# EAGLE schematic balancing_robot (EAGLE 7.4.0)
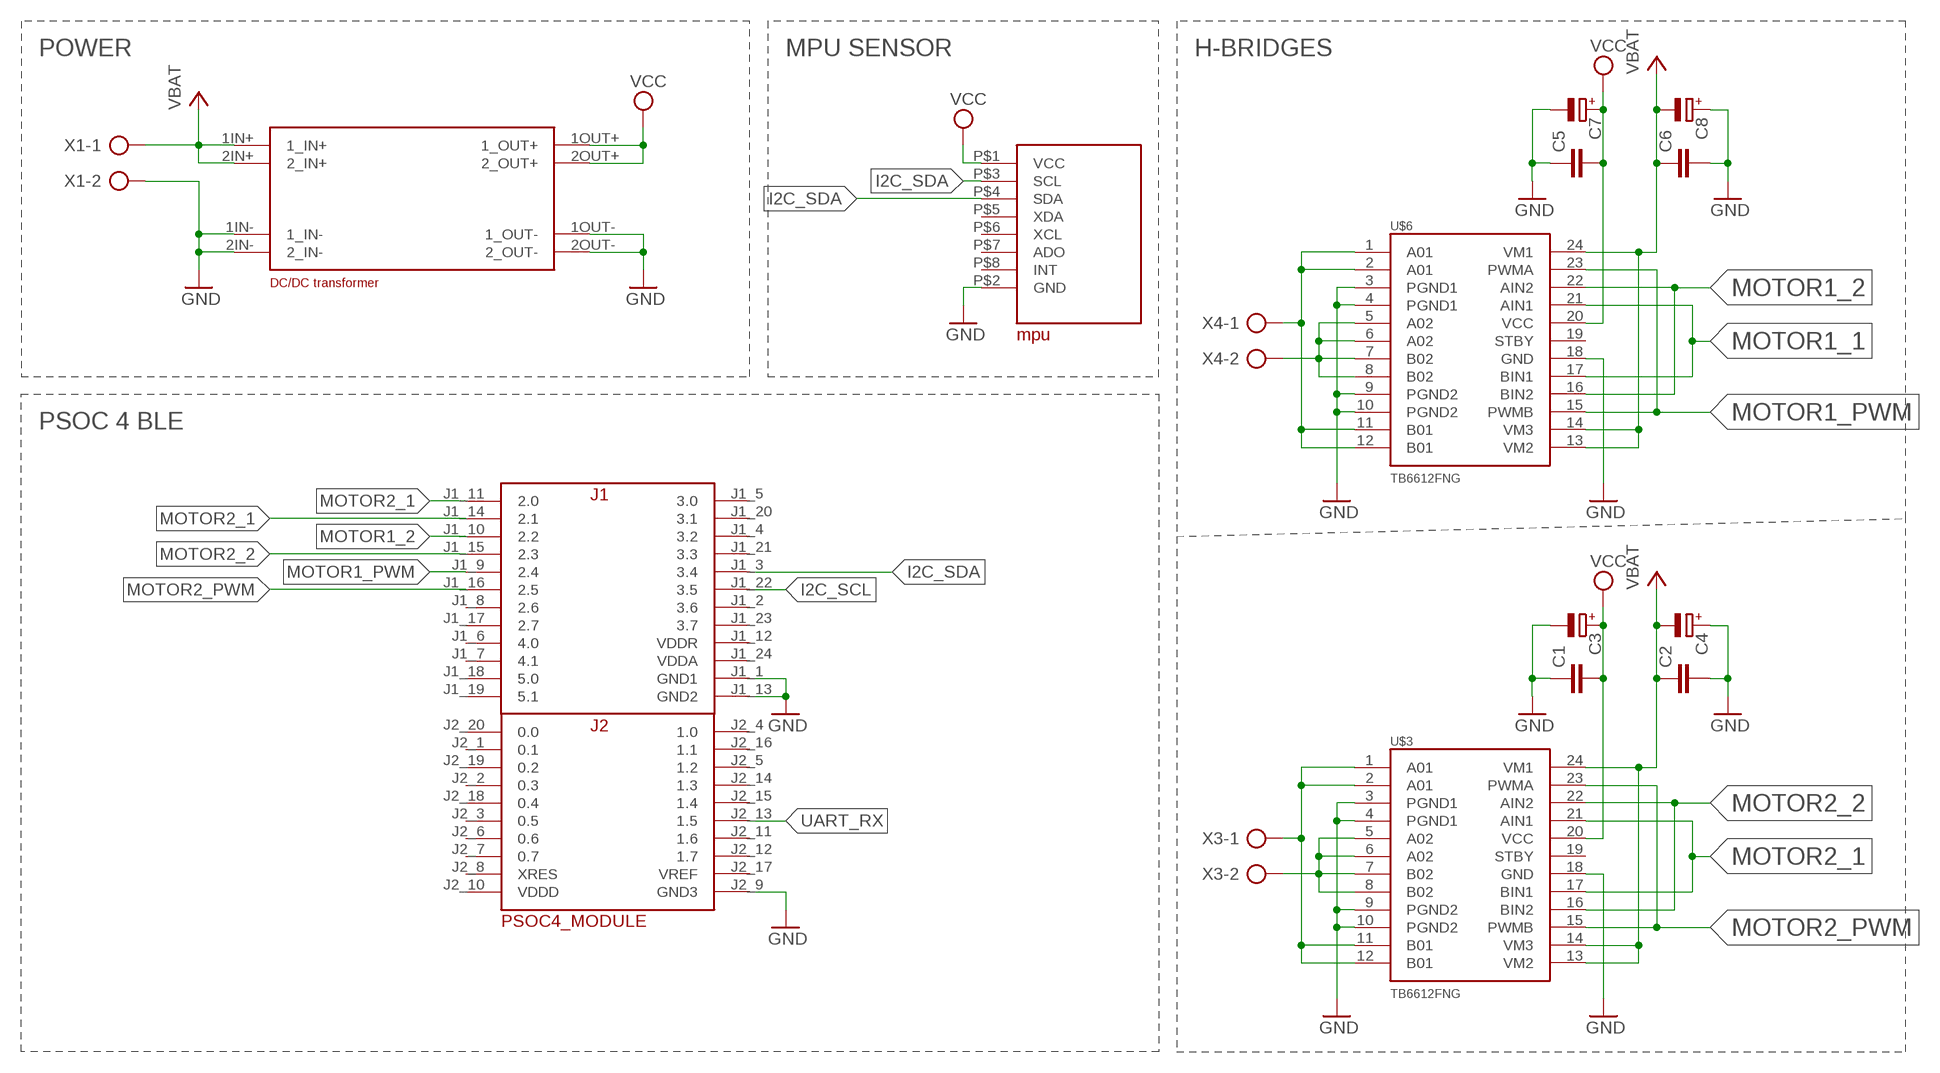
[diagram p0: schematic, sheet 1]

## Parts
C1  C-EUC0603  [C0603]
C2  C-EUC0603  [C0603]
C3  CPOL-EU153CLV-0405  [153CLV-0405]
C4  CPOL-EU153CLV-0405  [153CLV-0405]
C5  C-EUC0603  [C0603]
C6  C-EUC0603  [C0603]
C7  CPOL-EU153CLV-0405  [153CLV-0405]
C8  CPOL-EU153CLV-0405  [153CLV-0405]
U$1  PSOC4_MODULE  [PSOC4_MODULE]
U$3  TB6612FNG  [SSOP24]
U$4  TRANSFORMER  [TRANSFORMER]
U$5  MPU  [MPU]
U$6  TB6612FNG  [SSOP24]
X1  AK500/2  [AK500/2]
X3  AK500/2  [AK500/2]
X4  AK500/2  [AK500/2]

## Nets
GND: C1.1 C2.2 C3.- C4.+ C5.1 C6.2 C7.- C8.+ U$1.J1_1(GND1) U$1.J1_13(GND2) U$1.J2_9(GND3) U$3.18(GND) U$4.1IN-(1_IN-) U$4.1OUT-(1_OUT-) U$4.2IN-(2_IN-) U$4.2OUT-(2_OUT-) U$5.P$2(GND) U$6.18(GND) X1.2
I2C_SCL: U$1.J1_22(3.5)
I2C_SDA: U$1.J1_3(3.4) U$5.P$3(SCL) U$5.P$4(SDA)
MOTOR1_1: U$1.J1_11(2.0) U$6.17(BIN1) U$6.21(AIN1)
MOTOR1_2: U$1.J1_10(2.2) U$6.16(BIN2) U$6.22(AIN2)
MOTOR1_PWM: U$1.J1_9(2.4) U$6.15(PWMB) U$6.23(PWMA)
MOTOR2_1: U$1.J1_14(2.1) U$3.17(BIN1) U$3.21(AIN1)
MOTOR2_2: U$1.J1_15(2.3) U$3.16(BIN2) U$3.22(AIN2)
MOTOR2_PWM: U$1.J1_16(2.5) U$3.15(PWMB) U$3.23(PWMA)
N$1: U$3.1(A01) U$3.2(A01) U$3.11(B01) U$3.12(B01) X3.1
N$2: U$3.5(A02) U$3.6(A02) U$3.7(B02) U$3.8(B02) X3.2
N$5: U$3.3(PGND1) U$3.4(PGND1) U$3.9(PGND2) U$3.10(PGND2) U$6.3(PGND1) U$6.4(PGND1) U$6.9(PGND2) U$6.10(PGND2) ; supply symbol labelled GND
N$8: U$6.1(A01) U$6.2(A01) U$6.11(B01) U$6.12(B01) X4.1
N$9: U$6.5(A02) U$6.6(A02) U$6.7(B02) U$6.8(B02) X4.2
UART_RX: U$1.J2_13(1.5)
VCC: C1.2 C2.1 C3.+ C4.- C5.2 C6.1 C7.+ C8.- U$3.13(VM2) U$3.14(VM3) U$3.20(VCC) U$3.24(VM1) U$4.1IN+(1_IN+) U$4.1OUT+(1_OUT+) U$4.2IN+(2_IN+) U$4.2OUT+(2_OUT+) U$5.P$1(VCC) U$6.13(VM2) U$6.14(VM3) U$6.20(VCC) U$6.24(VM1) X1.1 ; supply symbol labelled VBAT
Unconnected: U$1.J1_2(3.6) U$1.J1_4(3.2) U$1.J1_5(3.0) U$1.J1_6(4.0) U$1.J1_7(4.1) U$1.J1_8(2.6) U$1.J1_12(VDDR) U$1.J1_17(2.7) U$1.J1_18(5.0) U$1.J1_19(5.1) U$1.J1_20(3.1) U$1.J1_21(3.3) U$1.J1_23(3.7) U$1.J1_24(VDDA) U$1.J2_1(0.1) U$1.J2_2(0.3) U$1.J2_3(0.5) U$1.J2_4(1.0) U$1.J2_5(1.2) U$1.J2_6(0.6) U$1.J2_7(0.7) U$1.J2_8(XRES) U$1.J2_10(VDDD) U$1.J2_11(1.6) U$1.J2_12(1.7) U$1.J2_14(1.3) U$1.J2_15(1.4) U$1.J2_16(1.1) U$1.J2_17(VREF) U$1.J2_18(0.4) U$1.J2_19(0.2) U$1.J2_20(0.0) U$3.19(STBY) U$5.P$5(XDA) U$5.P$6(XCL) U$5.P$7(ADO) U$5.P$8(INT) U$6.19(STBY)

## Notes on the sheet
- POWER | MPU SENSOR | H-BRIDGES
- PSOC 4 BLE

## Library data of the parts
C1 C2 C5 C6 = rcl:C-EU: CAPACITOR, European symbol
C3 C4 C7 C8 = rcl:CPOL-EU: POLARIZED CAPACITOR, European symbol
U$1 = PSOC4:PSOC4_MODULE
U$3 U$6 = SparkFun-PowerIC:TB6612FNG: Toshiba 1A dual motor driver IC-09363; PROD_ID: IC-09363
U$4 = DC_DC_transformer:TRANSFORMER
U$5 = MPU:MPU
X1 X3 X4 = con-ptr500:AK500/2: CONNECTOR; OC_FARNELL: unknown; OC_NEWARK: unknown